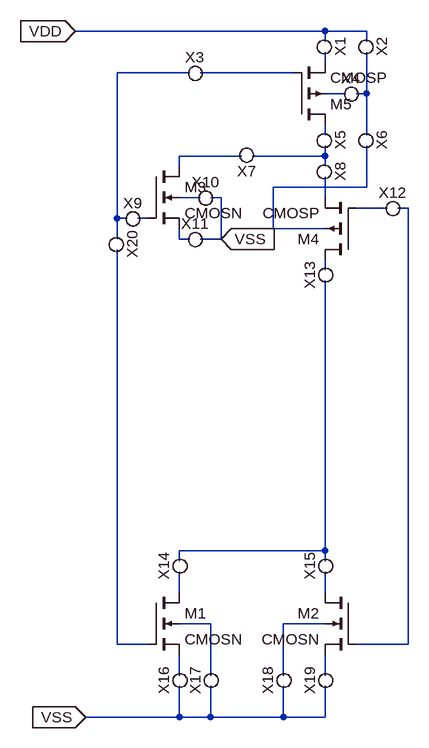
[diagram p0: schematic Draft3.asc]
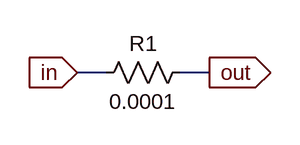
[diagram p1: sub-circuit para_register.asc]
Draft3.asc, the LTspice schematic file:
Version 4
SHEET 1 880 772
WIRE 624 -352 240 -352
WIRE 688 -352 624 -352
WIRE 624 -336 624 -352
WIRE 688 -336 688 -352
WIRE 624 -304 624 -320
WIRE 416 -288 304 -288
WIRE 576 -288 432 -288
WIRE 656 -256 624 -256
WIRE 688 -256 688 -320
WIRE 688 -256 672 -256
WIRE 624 -192 624 -208
WIRE 688 -192 688 -256
WIRE 496 -160 400 -160
WIRE 624 -160 624 -176
WIRE 624 -160 512 -160
WIRE 400 -144 400 -160
WIRE 624 -144 624 -160
WIRE 688 -112 688 -176
WIRE 688 -112 544 -112
WIRE 432 -96 400 -96
WIRE 464 -96 448 -96
WIRE 624 -96 624 -128
WIRE 720 -80 672 -80
WIRE 752 -80 736 -80
WIRE 304 -64 304 -288
WIRE 320 -64 304 -64
WIRE 352 -64 336 -64
WIRE 544 -48 544 -112
WIRE 624 -48 544 -48
WIRE 304 -32 304 -64
WIRE 400 -32 400 -48
WIRE 416 -32 400 -32
WIRE 464 -32 464 -96
WIRE 464 -32 432 -32
WIRE 624 16 624 0
WIRE 624 448 624 32
WIRE 752 592 752 -80
WIRE 624 448 400 448
WIRE 400 464 400 448
WIRE 624 464 624 448
WIRE 400 512 400 480
WIRE 624 512 624 480
WIRE 448 560 400 560
WIRE 624 560 560 560
WIRE 304 592 304 -16
WIRE 352 592 304 592
WIRE 752 592 672 592
WIRE 400 640 400 608
WIRE 448 640 448 560
WIRE 560 640 560 560
WIRE 624 640 624 608
WIRE 400 704 400 656
WIRE 400 704 256 704
WIRE 448 704 448 656
WIRE 448 704 400 704
WIRE 560 704 560 656
WIRE 560 704 448 704
WIRE 624 704 624 656
WIRE 624 704 560 704
FLAG 464 -32 VSS
IOPIN 464 -32 In
FLAG 240 -352 VDD
IOPIN 240 -352 In
FLAG 256 704 VSS
IOPIN 256 704 In
SYMBOL nmos4 352 512 R0
SYMATTR InstName M1
SYMATTR Value CMOSN
SYMATTR Value2 l={L6} w={W6} m={M6}
SYMBOL nmos4 672 512 M0
SYMATTR InstName M2
SYMATTR Value CMOSN
SYMATTR Value2 l={L7} w={W7} m={M7}
SYMBOL nmos4 352 -144 R0
SYMATTR InstName M3
SYMATTR Value CMOSN
SYMATTR Value2 l={L8} w={W8} m={M8}
SYMBOL pmos4 672 0 R180
SYMATTR InstName M4
SYMATTR Value CMOSP
SYMATTR Value2 l={L9} w={W9} m={M9}
SYMBOL pmos4 576 -208 M180
SYMATTR InstName M5
SYMATTR Value CMOSP
SYMATTR Value2 l={L10} w={W10} m={M10}
SYMBOL para_register 608 -336 R90
SYMATTR InstName X1
SYMBOL para_register 672 -336 R90
SYMATTR InstName X2
SYMBOL para_register 416 -272 R0
SYMATTR InstName X3
SYMBOL para_register 656 -240 R0
SYMATTR InstName X4
SYMBOL para_register 608 -192 R90
SYMATTR InstName X5
SYMBOL para_register 672 -192 R90
SYMATTR InstName X6
SYMBOL para_register 512 -176 R180
SYMATTR InstName X7
SYMBOL para_register 608 -144 R90
SYMATTR InstName X8
SYMBOL para_register 320 -48 R0
SYMATTR InstName X9
SYMBOL para_register 432 -80 R0
SYMATTR InstName X10
SYMBOL para_register 416 -16 R0
SYMATTR InstName X11
SYMBOL para_register 720 -64 R0
SYMATTR InstName X12
SYMBOL para_register 640 32 R270
SYMATTR InstName X13
SYMBOL para_register 416 480 R270
SYMATTR InstName X14
SYMBOL para_register 640 480 R270
SYMATTR InstName X15
SYMBOL para_register 416 656 R270
SYMATTR InstName X16
SYMBOL para_register 464 656 R270
SYMATTR InstName X17
SYMBOL para_register 576 656 R270
SYMATTR InstName X18
SYMBOL para_register 640 656 R270
SYMATTR InstName X19
SYMBOL para_register 288 -32 R90
SYMATTR InstName X20

para_register.asc, the sub-circuit schematic file:
Version 4
SHEET 1 880 680
WIRE 160 -176 128 -176
WIRE 272 -176 240 -176
FLAG 128 -176 in
IOPIN 128 -176 In
FLAG 272 -176 out
IOPIN 272 -176 Out
SYMBOL res 256 -192 R90
WINDOW 0 0 56 VBottom 2
WINDOW 3 32 56 VTop 2
SYMATTR InstName R1
SYMATTR Value 0.0001

The netlist it stands for:
* Draft3.asc
M1 N018 N022 N023 N020 CMOSN l={L6} w={W6} m={M6}
M2 N019 N013 N024 N021 CMOSN l={L7} w={W7} m={M7}
M3 N007 N014 N015 N010 CMOSN l={L8} w={W8} m={M8}
M4 N016 N012 N011 N009 CMOSP l={L9} w={W9} m={M9}
M5 N006 N003 N001 N004 CMOSP l={L10} w={W10} m={M10}
XX1 VDD N001 para_register
XX2 VDD N005 para_register
XX3 N002 N003 para_register
XX4 N004 N005 para_register
XX5 N006 N008 para_register
XX6 N005 N009 para_register
XX7 N008 N007 para_register
XX8 N008 N011 para_register
XX9 N002 N014 para_register
XX10 N010 VSS para_register
XX11 N015 VSS para_register
XX12 N012 N013 para_register
XX13 N017 N016 para_register
XX14 N018 N017 para_register
XX15 N019 N017 para_register
XX16 VSS N023 para_register
XX17 VSS N020 para_register
XX18 VSS N021 para_register
XX19 VSS N024 para_register
XX20 N002 N022 para_register

* block symbol definitions
.subckt para_register in out
R1 out in 0.0001
.ends para_register

.model NMOS NMOS
.model PMOS PMOS
.lib standard.mos
.backanno
.end